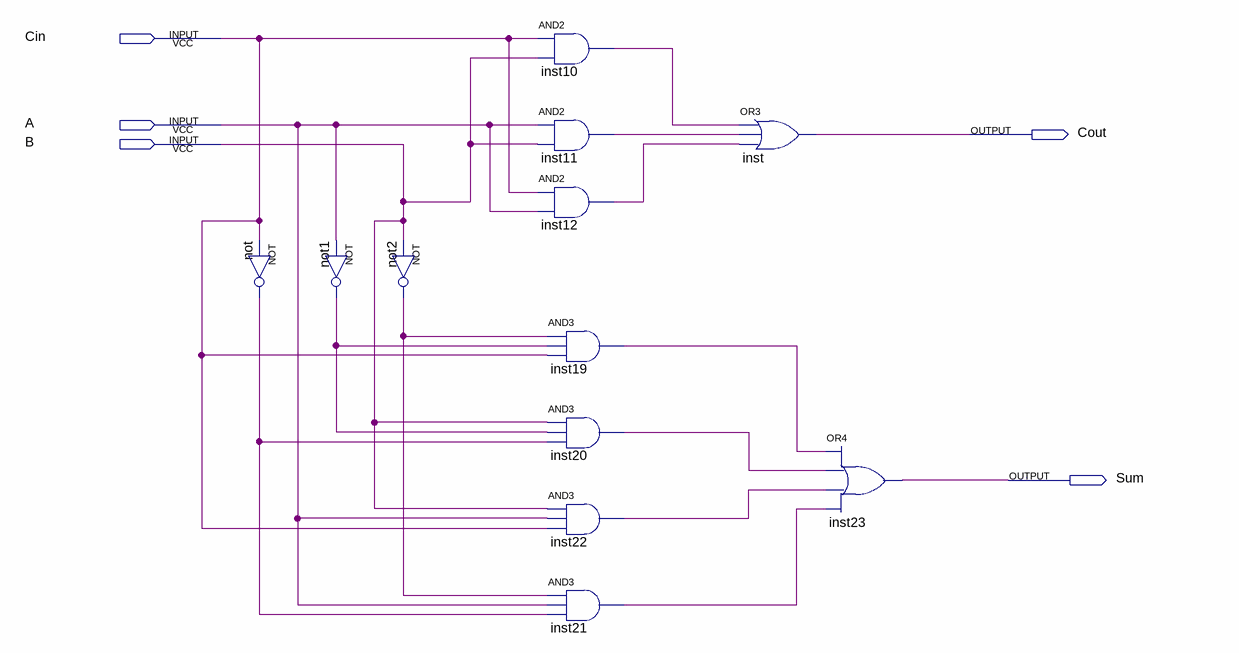
[diagram p0: schematic sheet]
// Quartus schematic full_adder.bdf as structural Verilog: 12 symbols, 5 pins
module full_adder (
  input  Cin,
  input  A,
  input  B,
  output Cout,
  output Sum
);

  wire inst10_out, inst11_out, inst12_out, inst19_out, inst20_out, inst21_out, inst22_out, not1_out,
       not2_out, not_out;

  not \not  (not_out, Cin);
  not not1 (not1_out, A);
  not not2 (not2_out, B);
  and inst10 (inst10_out, Cin, B);
  and inst11 (inst11_out, A, B);
  and inst12 (inst12_out, Cin, A);
  and inst19 (inst19_out, not2_out, not1_out, Cin);
  and inst20 (inst20_out, B, not1_out, not_out);
  and inst22 (inst22_out, B, A, Cin);
  and inst21 (inst21_out, not2_out, A, not_out);
  or inst (Cout, inst10_out, inst11_out, inst12_out);
  or inst23 (Sum, inst19_out, inst20_out, inst22_out, inst21_out);
endmodule
